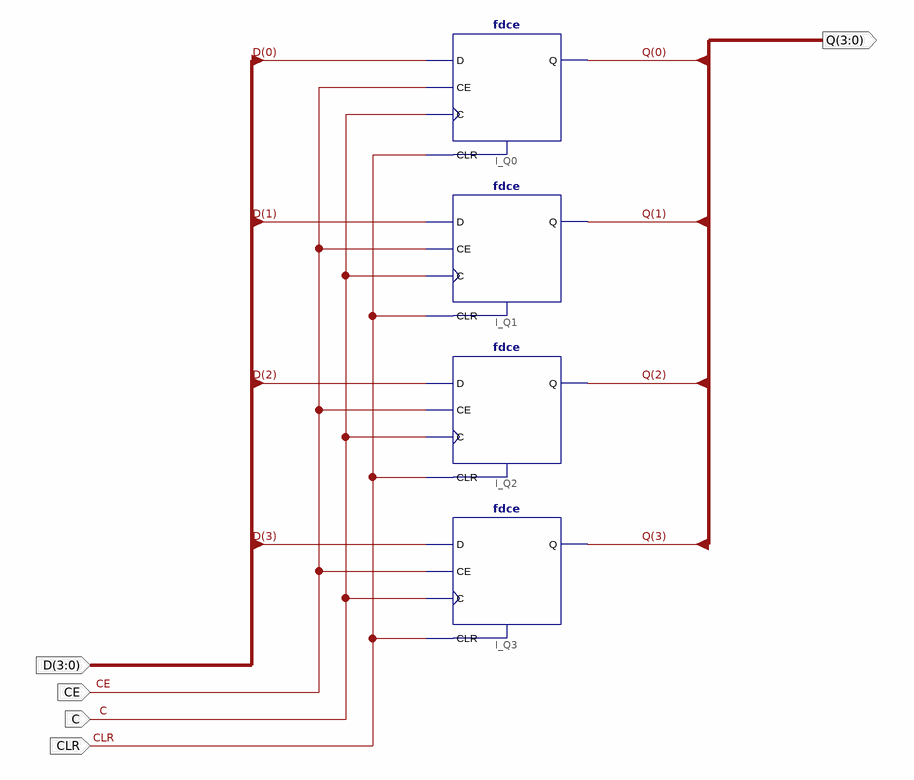
[diagram p0: schematic sheet 1]
// Xilinx ISE schematic FD4CE_B.sch (spartan3e) as structural Verilog: 4 symbols, 5 ports
module FD4CE_B (
  input  [3:0] D,
  input  CE,
  input  C,
  input  CLR,
  output [3:0] Q
);

  fdce I_Q0 (.C(C), .CE(CE), .CLR(CLR), .D(D[0]), .Q(Q[0]));
  fdce I_Q1 (.C(C), .CE(CE), .CLR(CLR), .D(D[1]), .Q(Q[1]));
  fdce I_Q2 (.C(C), .CE(CE), .CLR(CLR), .D(D[2]), .Q(Q[2]));
  fdce I_Q3 (.C(C), .CE(CE), .CLR(CLR), .D(D[3]), .Q(Q[3]));
endmodule
